# Altium schematic sheet 3V3_5V.SchDoc
size A; SheetNumber: 4; SheetTotal: 5
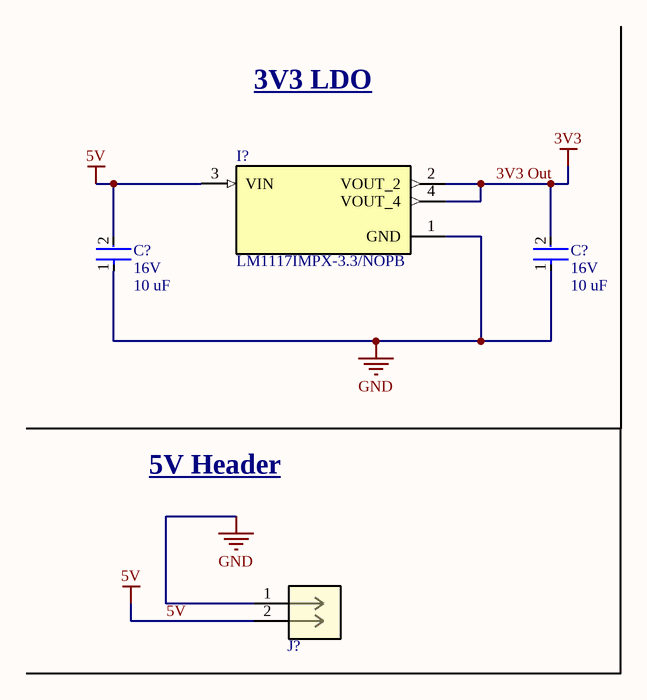
[diagram p0: 3V3_5V.SchDoc]

## Parts
(Parts that share a designator on the sheet are numbered #1, #2 ... from top to bottom, then left to right.)
C?#1  Voltage: 16V  Capacitance: 10 uF  [CAP-1206]  (hidden comment: 293D106X9016A2TE3)
C?#2  Voltage: 16V  Capacitance: 10 uF  [CAP-1206]  (hidden comment: 293D106X9016A2TE3)
I?  LM1117IMPX-3.3/NOPB  [IC-SOT-223-4]
J?  S2B-PH-K-SLFSN  [CONN-2POS-JST]  (value not drawn)

## Nets
3V3 Out: C?#2.2 I?.2(VOUT_2) I?.4(VOUT_4)  [also labelled 3V3]
5V: C?#1.2 I?.3(VIN) J?.2
GND: C?#1.1 C?#2.1 I?.1(GND) J?.1

## Notes on the sheet
- 3V3 LDO
- 5V Header

## Library data of the parts
C?#1 C?#2 = CAP-10U-0004: CAP TANT 10UF 10% 16V 1206; Device Class: Tantalum; Size: 1206; ComponentLink1Description: Datasheet; ComponentLink1URL: https://www.lcsc.com/datasheet/lcsc_datasheet_2304140030_Vishay-Intertech-293D106X9016A2TE3_C110038.pdf
I? = IC_LDO_3V3_0001: IC REG LIN 3.3V 800MA SOT223-4; ComponentLink1Description: New link; ComponentLink1URL: https://www.ti.com/lit/ds/symlink/lm1117.pdf?HQS=dis-dk-null-digikeymode-dsf-pf-null-wwe&ts=1721700739746
J? = CONN-2POS-JST: Connector Header Through Hole, Right Angle 2 position 0.079" (2.00mm); Mfr_Name: JST; RefDes: RefDes; Type: Type